# Altium schematic sheet Filtr2.SchDoc
size A4; Organization: OLTEST; Revision: 01; SheetNumber: 1; SheetTotal: 1; Разработчик: Бондарчук С.; Прибор: R100-01; АМАК.000000.000 Э3: R100.230.050.000-01; Дата: 14.01.2020; Формат: A4; PageSetup: Record=PageOptions|CenterHorizontal=True|CenterVertical=True|PrintScale=0.97|XCorrection=1.00|YCorrection=1.00|PrintKind=1|BorderSize=5000000|LeftOffset=0|BottomOffset=0|Orientation=2|PaperLength=2970|PaperWidth=2100|Scale=100|PaperSource=7|PrintQuality=600|MediaType=1|DitherType=10|PrintScaleMode=1|PaperKind=A4|PaperIndex=9; WorkSpaceName: R100.230-01 (Boards)
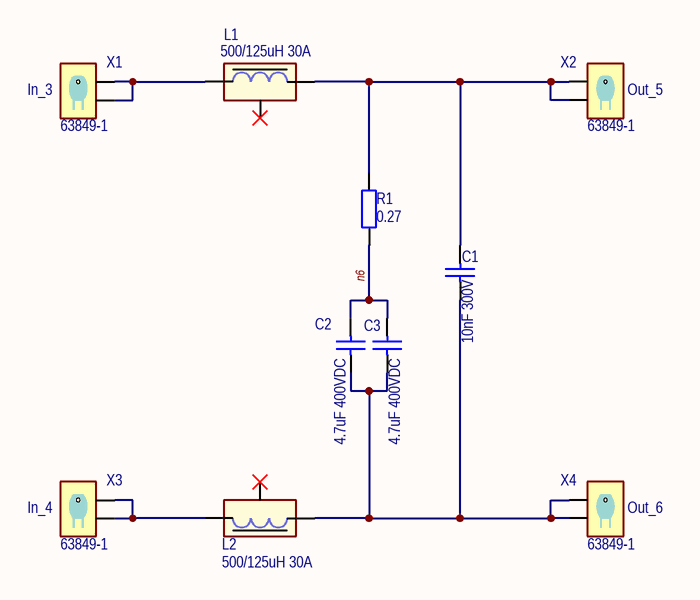
[diagram p0: Filtr2.SchDoc]

## Parts
C1  10nF 300V  [C Y2 D13 7.5b]
C2  4.7uF 400VDC  [MKP_W20_H39.5_L41.5_LS37.5]
C3  4.7uF 400VDC  [MKP_W20_H39.5_L41.5_LS37.5]
L1  500/125uH 30A  [Dross (500/125 uH 30 A)AMAK.671111.034]
L2  500/125uH 30A  [Dross (500/125 uH 30 A)AMAK.671111.034]
R1  0.27  [PRW 5W 1050]
X1  63849-1  [63849-1+insulator(154719-1)]
X2  63849-1  [63849-1+insulator(154719-1)]
X3  63849-1  [63849-1+insulator(154719-1)]
X4  63849-1  [63849-1+insulator(154719-1)]

## Nets
n6: C2.2 C3.2 R1.1
NetC1_1: C1.1 C2.1 C3.1 L2.1 X4.1 X4.2
NetC1_2: C1.2 L1.2 R1.2 X2.1 X2.2
NetL1_1: L1.1 X1.1 X1.2
NetL2_2: L2.2 X3.1 X3.2

Not connected (* = marked no-connect by the designer): L1 3*; L2 3*

## Notes on the sheet
- (near X1) In_3
- (near X2) Out_5
- (near X3) In_4
- (near X4) Out_6
- Разработчик:
- Формат:
- Rev.:
- Лист
- Дата:
- Листов
- WorkSpace:
- Дата изм.:

## Library data of the parts
C1 = C X1Y2 10nF D13 LS7.5: Ceramic D=14 LS=7.5 300VAC X1Y2; PartNumber: DE2F3KY103MA3; Manufacturer: Murata; Value: 10nF 300V
C2 C3 = MKP1 4.7uF 10% 400VDC: Polypropelene W20 H39.5 L41.5 LS37.5 400VDC 10%; PartNumber: MKP1G044707G00K; Manufacturer: Wima; Value: 4.7uF 400VDC
L1 L2 = Dross 500/125uH 30A АМАК.671111.034: 500/125uH 30A  (Core T250-52 X1); Manufacturer: OLTEST; PartNumber: АМАК.671111.034; Value: 500/125uH 30A
R1 = PRW 0.27 5W +-5%: Выводной PRW 5W 0R27 +-5%; PartNumber: PRW05WJW27K; Manufacturer: RoyalOhm; Value: 0.27
X1-X4 = 63849-1: PCB, 6.3х0.8, hole; Manufacturer: TE Connectivity; PartNumber: 63849-1